# Altium schematic sheet Port.SchDoc
size A4; SheetNumber: 5; SheetTotal: 6
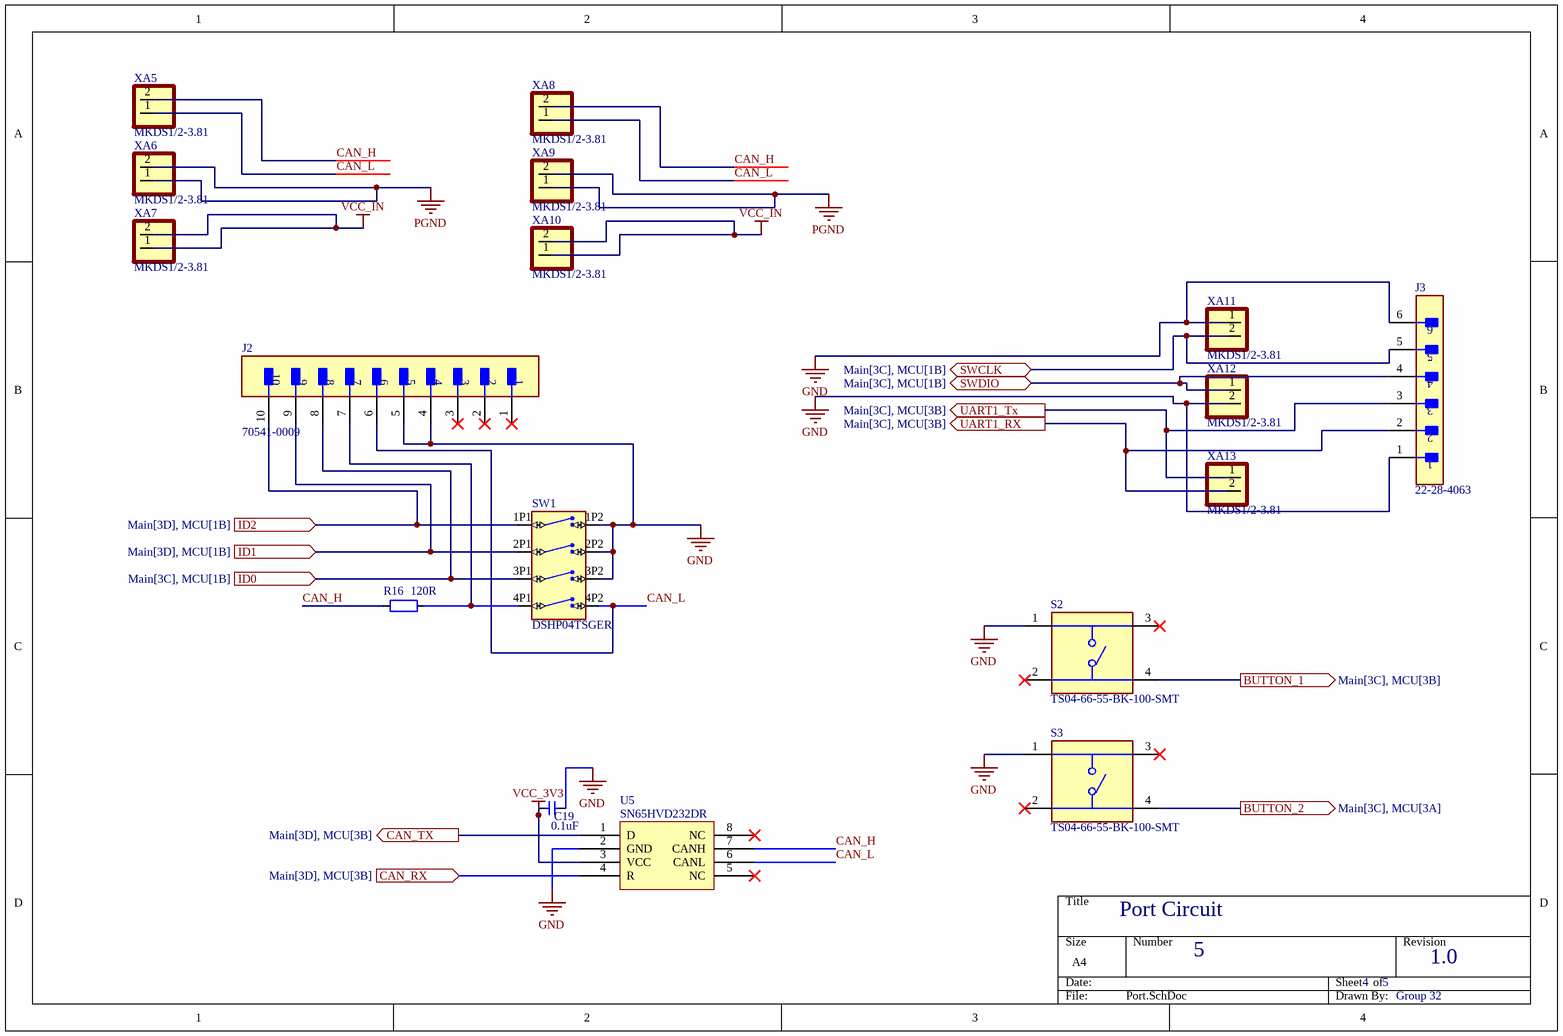
[diagram p0: Port.SchDoc]

## Parts
C19  0.1uF  [CAPC2013X94X50LL20T25]
J2  70541-0009  [FP-70541-0009-MFG]
J3  22-28-4063  [FP-22-28-4063-MFG]
R16  120R  [RESC3116X65N]
S2  TS04-66-55-BK-100-SMT  [SW_TS04-66-55-BK-100-SMT]
S3  TS04-66-55-BK-100-SMT  [SW_TS04-66-55-BK-100-SMT]
SW1  DSHP04TSGER  [DSHP04TSGER]
U5  Manufacturer Part Number: SN65HVD232DR  [SOIC127P599X175-8N]  (hidden comment: SN65HVD232D)
XA5  MKDS1/2-3.81  [PHOENIX_MKDS1/2-3.81 - duplicate]
XA6  MKDS1/2-3.81  [PHOENIX_MKDS1/2-3.81 - duplicate]
XA7  MKDS1/2-3.81  [PHOENIX_MKDS1/2-3.81 - duplicate]
XA8  MKDS1/2-3.81  [PHOENIX_MKDS1/2-3.81 - duplicate]
XA9  MKDS1/2-3.81  [PHOENIX_MKDS1/2-3.81 - duplicate]
XA10  MKDS1/2-3.81  [PHOENIX_MKDS1/2-3.81 - duplicate]
XA11  MKDS1/2-3.81  [PHOENIX_MKDS1/2-3.81 - duplicate]
XA12  MKDS1/2-3.81  [PHOENIX_MKDS1/2-3.81 - duplicate]
XA13  MKDS1/2-3.81  [PHOENIX_MKDS1/2-3.81 - duplicate]

## Ports
BUTTON_1 (out, see Main[3C], MCU[3B]), BUTTON_2 (out, see Main[3C], MCU[3A]), CAN_RX (in, see Main[3D], MCU[3B]), CAN_TX (out, see Main[3D], MCU[3B]), ID0 (in, see Main[3C], MCU[1B]), ID1 (in, see Main[3D], MCU[1B]), ID2 (in, see Main[3D], MCU[1B]), SWCLK (bidir, see Main[3C], MCU[1B]), SWDIO (bidir, see Main[3C], MCU[1B]), UART1_RX (out, see Main[3C], MCU[3B]), UART1_Tx (out, see Main[3C], MCU[3B])

## Nets
GND: C19.1 J2.4 J2.5 J3.1 J3.6 S2.1 S3.1 SW1.1P2 SW1.2P2 SW1.3P2 U5.2(GND) XA11.1 XA12.2
PGND: XA6.1 XA6.2 XA9.1 XA9.2
VCC_3V3: C19.2 U5.3(VCC)
VCC_IN: XA7.1 XA7.2 XA10.1 XA10.2
BUTTON_1: S2.4 ; port BUTTON_1
BUTTON_2: S3.4 ; port BUTTON_2
CAN_H: R16.1 U5.7(CANH) XA5.2 XA8.2
CAN_L: J2.6 SW1.4P2 U5.6(CANL) XA5.1 XA8.1
CAN_RX: U5.4(R) ; port CAN_RX
CAN_TX: U5.1(D) ; port CAN_TX
ID0: J2.8 SW1.3P1 ; port ID0
ID1: J2.9 SW1.2P1 ; port ID1
ID2: J2.10 SW1.1P1 ; port ID2
SWCLK: J3.5 XA11.2 ; port SWCLK
SWDIO: J3.4 XA12.1 ; port SWDIO
UART1_RX: J3.2 XA13.2 ; port UART1_RX
UART1_Tx: J3.3 XA13.1 ; port UART1_Tx
NetJ2_7: J2.7 R16.2 SW1.4P1

Not connected (* = marked no-connect by the designer): J2 1* 2* 3*; S2 2* 3*; S3 2* 3*; U5 5(NC)* 8(NC)*

## Notes on the sheet
- Port Circuit
- 5
- 4
- 1.0
- Group 32

## Library data of the parts
C19 = 电容-0402: Capacitor; Value: 0.1u
J2 = CMP-04776-001054-1: CONN HEADER VERT 10POS 2.54MM; Current Rating: 3A; Number of Positions: 10; Contact Post Length: 3.3mm; Voltage Rating: 250V; Contact Resistance: 15mR; Glow Wire Compliant: Non-compliant; Series: 70541; Pitch: 2.54mm; Orientation: Vertical; Contact Material: Bronze; Number of Rows: 1; Min Operating Temperature: -40°C; Flammability Rating: UL94 V-0; Number of Contacts: 10; Packaging: Rail/Tube; Contact Plating: Tin; Number of Circuits: 10; Housing Material: Polyester; Termination: Through Hole; Material: Brass; Max Operating Temperature: 105°C; Package Quantity: 768; Mount: Through Hole; Contact Mating Length: 6.1mm; ELV: Compliant; Contact Gender: Male
J3 = CMP-04776-000885-1: CONN HEADER VERT 6POS 2.54MM; Number of Circuits: 6; Voltage Rating (DC): 250V; Connector Type: Male Pin; Contact Resistance: 20mR; Glow Wire Compliant: Non-compliant; Gender: Male; Current Rating: 4A; Max Voltage Rating (DC): 250.25kV; Series: KK® 42375; Termination: Solder; Orientation: Straight; Max Operating Temperature: 75°C; Min Operating Temperature: 0°C; Mount: Through Hole; Depth: 2.49mm; Contact Material: Brass; Number of Positions: 6; Contact Mating Length: 0.24inch; Number of Rows: 1; Housing Color: Black; Max Voltage Rating (AC): 250V; Housing Material: Thermoplastic; Packaging: Bulk; Contact Plating: Gold; Contact Type: Male Pin; Package Quantity: 1; Number of Contacts: 6; Voltage Rating: 250V; Lead Free: Lead Free; RoHS Compliant: Yes; Pitch: 2.54mm; Color: Black; Flammability Rating: UL94 V-0; Radiation Hardening: No
R16 = 电阻-0402: Resistor; Value: 22R
S2 S3 = TS04-66-55-BK-100-SMT: 6 x 6 mm, 4.3~9.5 mm Actuator Height, 100~260 gf, Surface Mount, SPST, Tactile Switch; MF: CUI Devices; Value: *; MP: TS04-66-55-BK-100-SMT; Package: None; Purchase-URL: https://pricing.snapeda.com/search/part/TS04-66-55-BK-100-SMT/?ref=eda; Price: None; Check_prices: https://www.snapeda.com/parts/TS04-66-55-BK-100-SMT/CUI+Devices/view-part/?ref=eda; CUI_purchase_URL: https://www.cuidevices.com/product/switches/tactile-switches/ts04-series?utm_source=snapeda.com&utm_medium=referral&utm_campaign=snapedaBOM; Availability: In Stock; SnapEDA_Link: https://www.snapeda.com/parts/TS04-66-55-BK-100-SMT/CUI+Devices/view-part/?ref=snap
SW1 = DSHP04TSGER: Switch DIP ON OFF SPST 4 Recessed Slide 0.025A 24VDC Gull Wing 1000Cycles 1.27mm SMD T/R; MF: KINGTEK INDUSTRIAL; MP: DSHP04TSGER; Package: None; Check_prices: https://www.snapeda.com/parts/DSHP04TSGER/GTE/view-part/?ref=eda; SnapEDA_Link: https://www.snapeda.com/parts/DSHP04TSGER/GTE/view-part/?ref=snap; Availability: In Stock; Price: None; Value: *
U5 = SN65HVD232D: Manufacturer: Texas Instruments; Protocol: CAN; Number of Drivers/Receivers: 1/1; Duplex: Half; Data Rate: 1Mbps; Voltage - Supply: 3 V ~ 3.6 V; Supplier 1: Digi-Key; Supplier Part Number 1: 296-26344-2-ND; RoHS: RoHS Compliant; Category: Integrated Circuits (ICs); Stock: 5000; Pricing 1: 2500=0.84375 (USD); Packaging: Tape & Reel (TR); Part Status: Active; Type: Transceiver; Operating Temperature: -40°C ~ 85°C; Mounting Type: Surface Mount; Package / Case: 8-SOIC (0.154", 3.90mm Width); Supplier Device Package: 8-SOIC; ComponentLink1URL: http://www.ti.com/lit/ds/symlink/sn65hvd230.pdf; ComponentLink1Description: http://www.ti.com/lit/ds/symlink/sn65hvd230.pdf; Supplier 2: Digi-Key; Supplier Part Number 2: 296-26344-1-ND; Pricing 2: 1=2.05, 10=1.842, 100=1.4809, 500=1.21668, 1000=1.00811 (USD)
XA5-XA13 = MKDS1/2-3.81: 2 Position Wire to Board Terminal Block Horizontal with Board 0.150 _3.81mm_ Through Hole; MF: Phoenix Contact; Package: None; Price: None; SnapEDA_Link: https://www.snapeda.com/parts/MKDS%201/%202-3.81/Phoenix%20Contact/view-part/114562/?ref=snap; Availability: Unavailable; Value: *; MP: MKDS 1/ 2-3.81